# EAGLE design Controller (EAGLE 9.6.2)
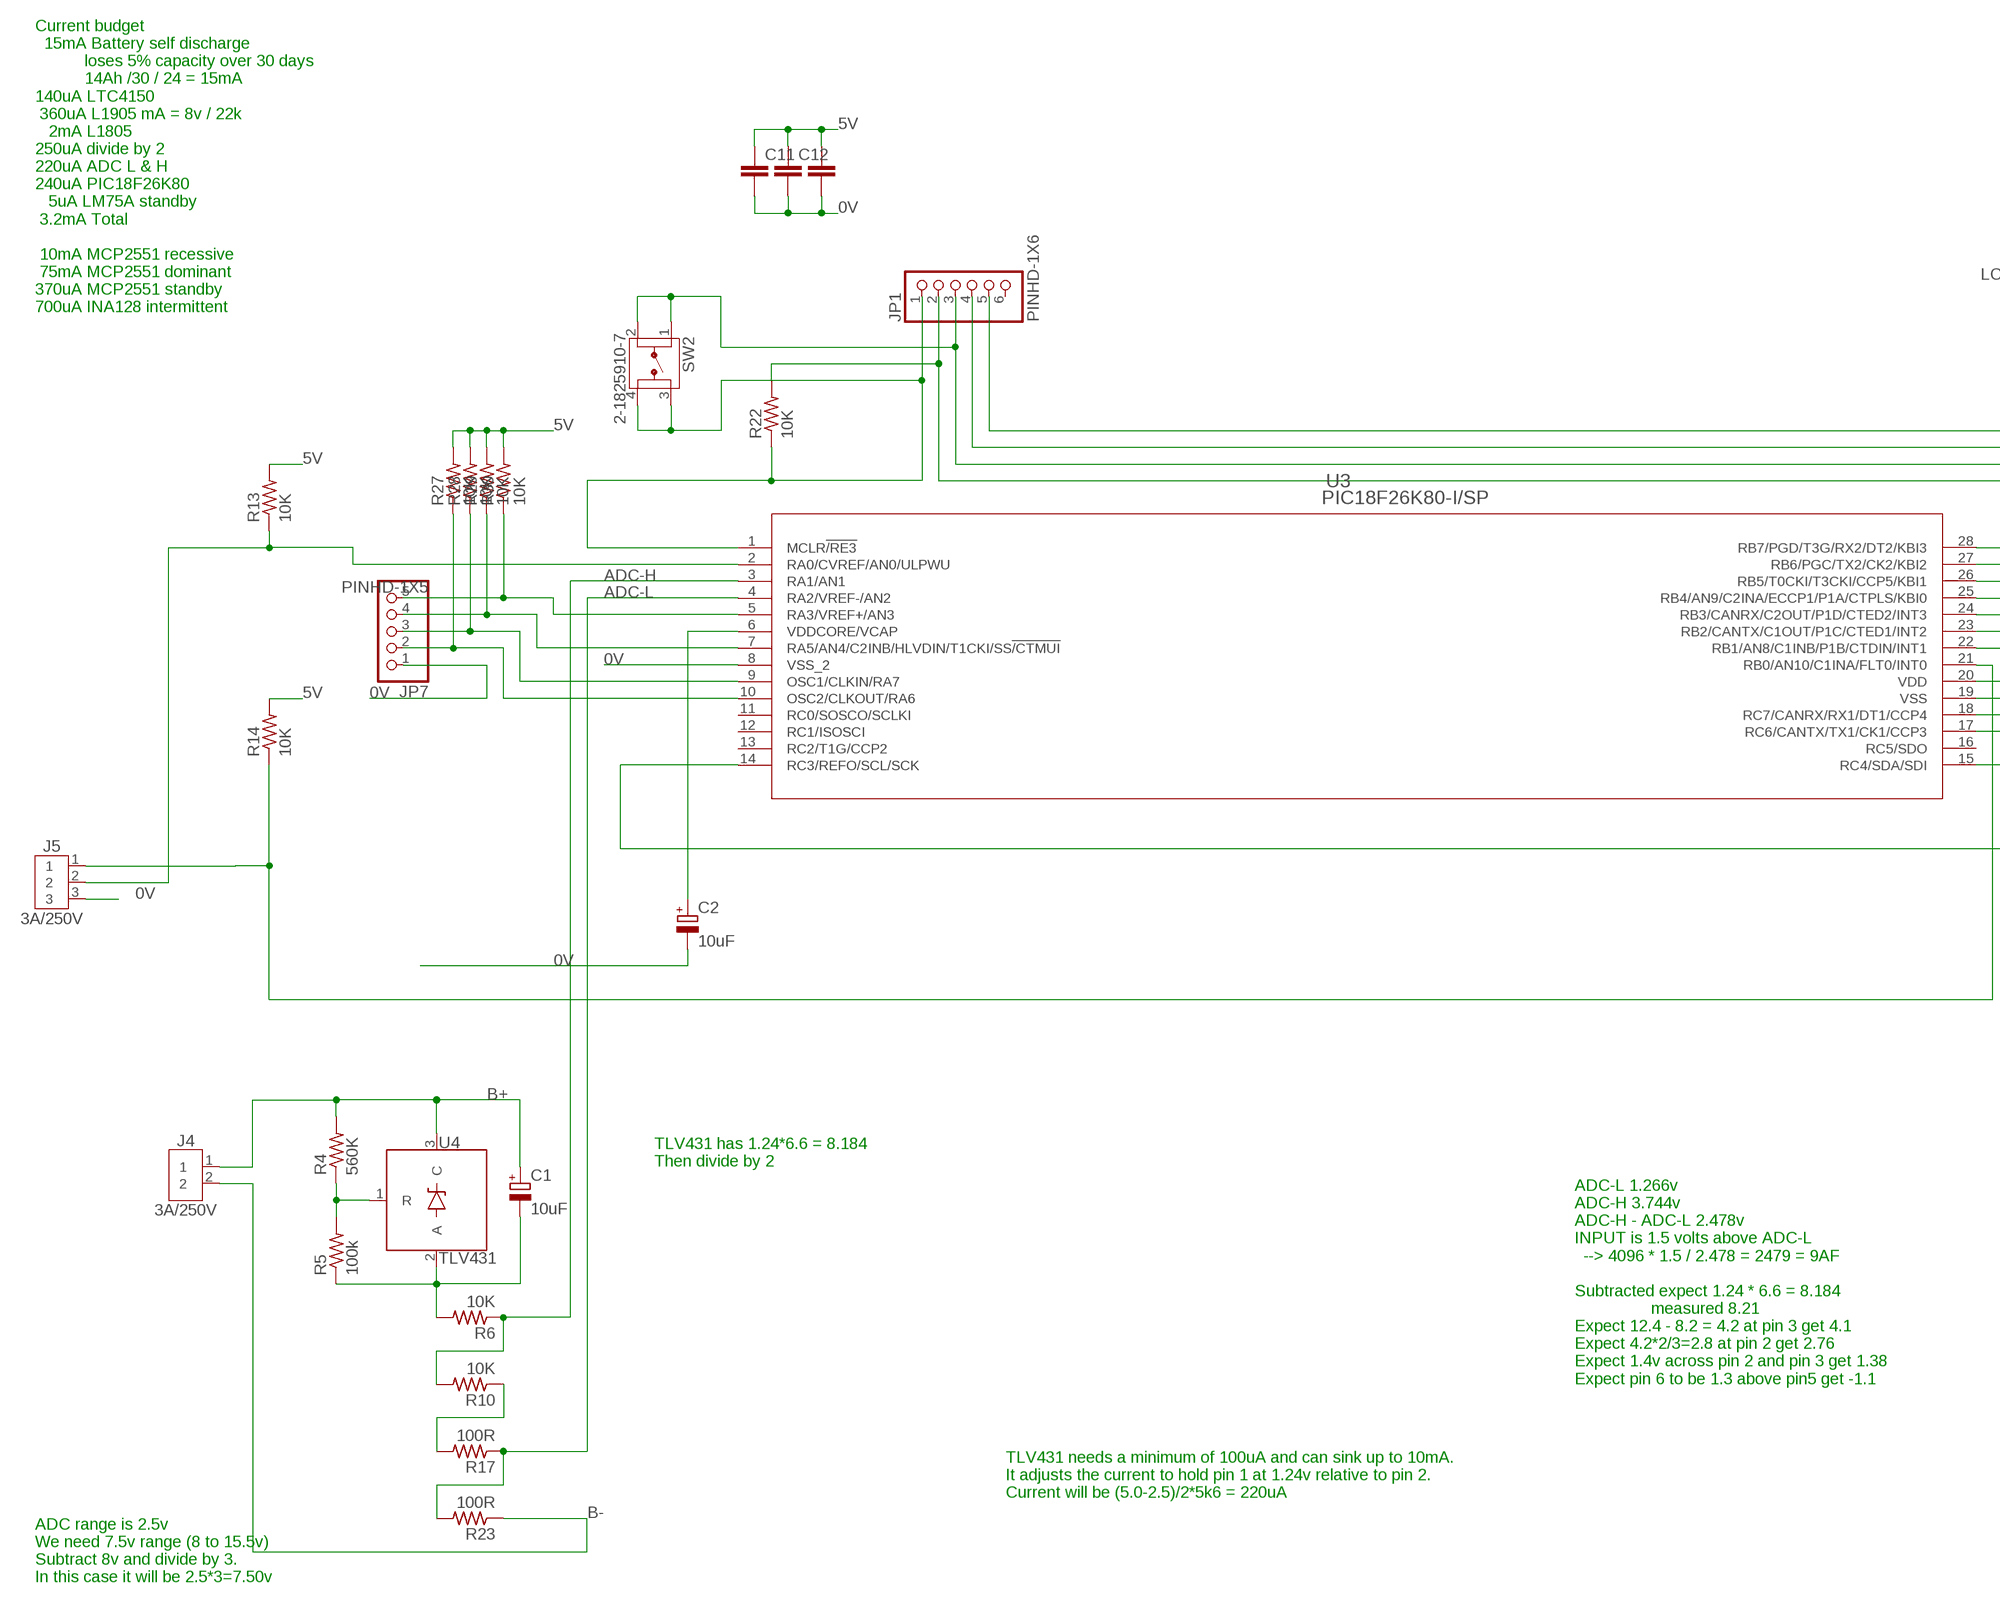
[diagram p0: schematic, sheet 1, part 1 of 2]
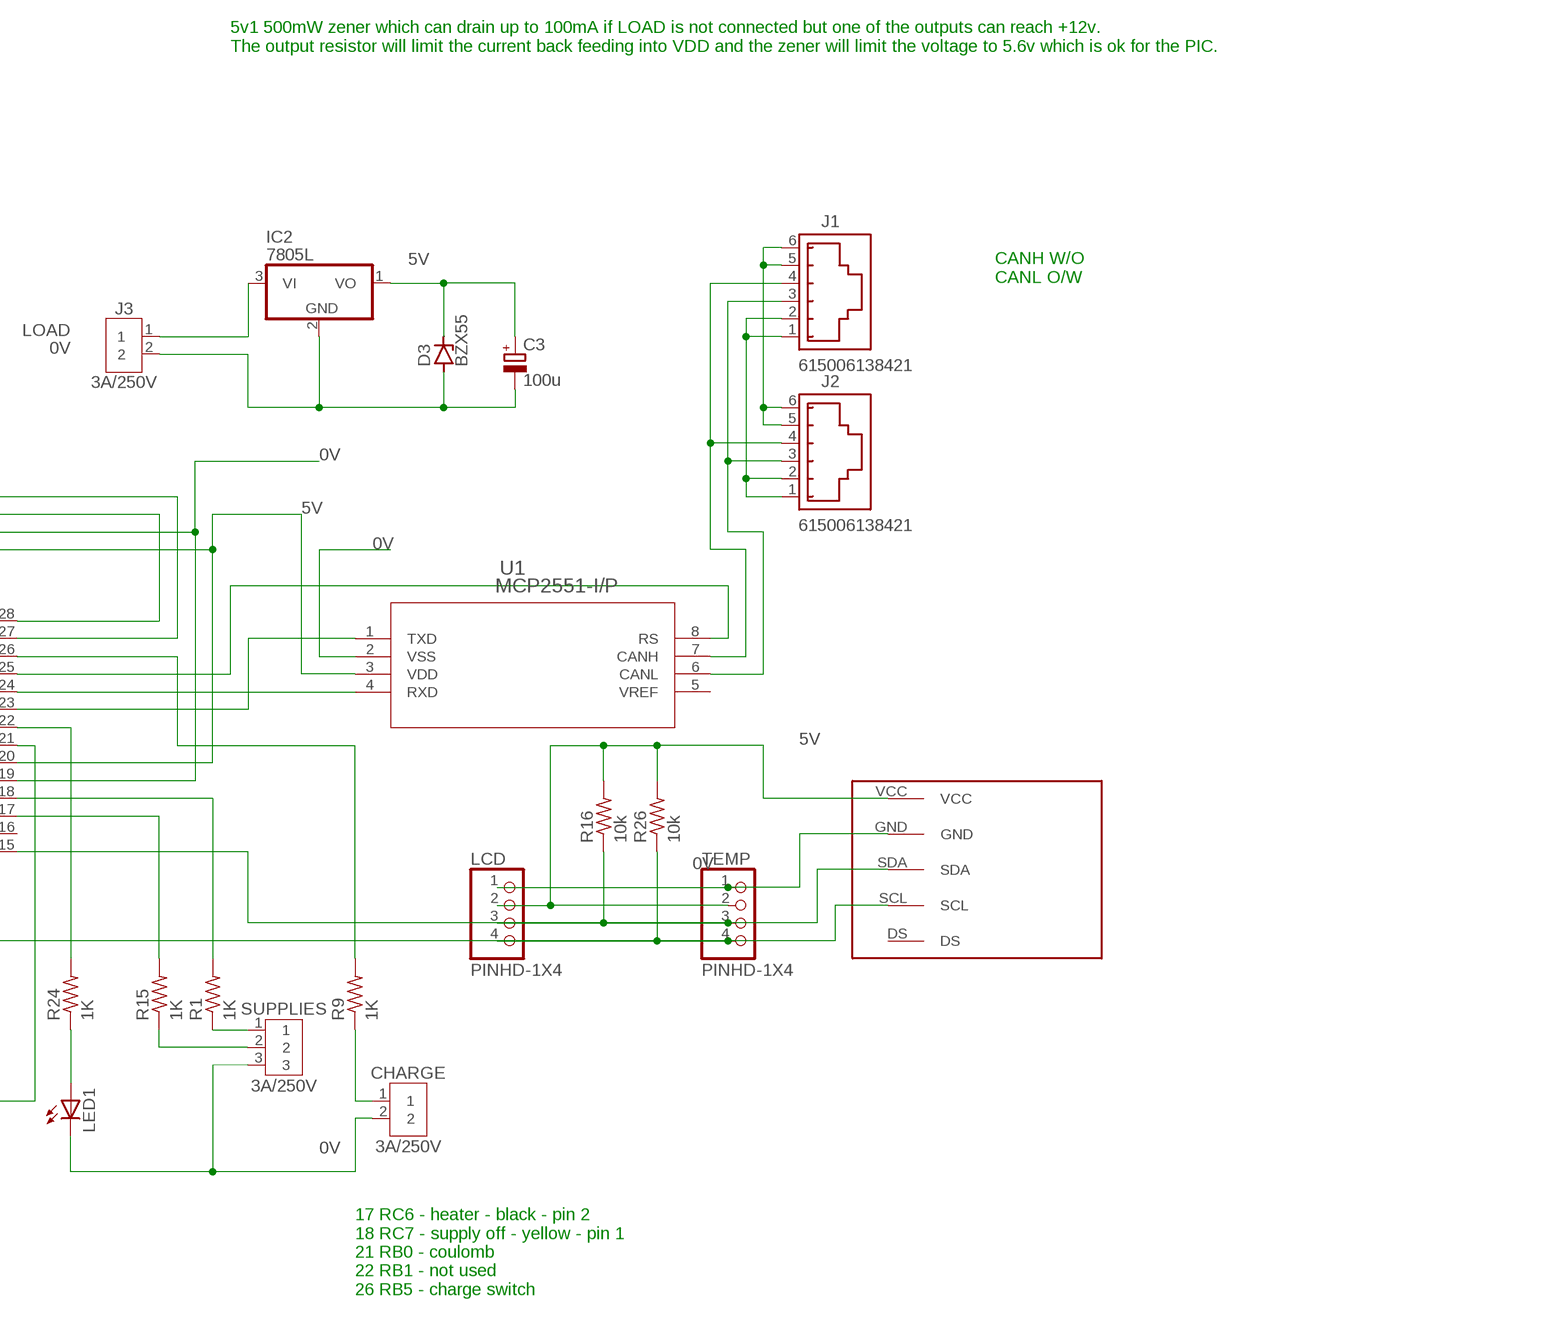
[diagram p1: schematic, sheet 1, part 2 of 2]

## Parts
C1  10uF  CPOL-EUE3.5-8  [E3,5-8]
C2  10uF  CPOL-EUE3.5-8  [E3,5-8]
C3  100u  CPOL-EUE3.5-8  [E3,5-8]
C7  C2,5-3  [C2.5-3]
C11  C2,5-3  [C2.5-3]
C12  C2,5-3  [C2.5-3]
CHARGE  3A/250V  B2B-XH-A  [B2B-XH-A]
D3  BZX55  [DO35Z10]
IC2  7805L  [TO92]
J1  615006138421  [615006138421]
J2  615006138421  [615006138421]
J3  3A/250V  B2B-XH-A  [B2B-XH-A]
J4  3A/250V  B2B-XH-A  [B2B-XH-A]
J5  3A/250V  B3B-XH-A  [B3B-XH-A]
JP1  PINHD-1X6  [1X06]
JP7  PINHD-1X5  [1X05]
LCD  PINHD-1X4  [1X04]
LED1  LED3MM  [LED3MM]
R1  1K  RES_7  [0204/7]
R4  560K  RES_7  [0204/7]
R5  100k  RES_7  [0204/7]
R6  10K  RES_7  [0204/7]
R9  1K  RES_7  [0204/7]
R10  10K  RES_7  [0204/7]
R13  10K  RES_7  [0204/7]
R14  10K  RES_7  [0204/7]
R15  1K  RES_7  [0204/7]
R16  10k  RES_7  [0204/7]
R17  100R  RES_7  [0204/7]
R22  10K  RES_7  [0204/7]
R23  100R  RES_7  [0204/7]
R24  1K  RES_7  [0204/7]
R26  10k  RES_7  [0204/7]
R27  10K  RES_70204/7-90  [0204/7-90]
R28  10K  RES_70204/7-90  [0204/7-90]
R29  10K  RES_70204/7-90  [0204/7-90]
R30  10K  RES_70204/7-90  [0204/7-90]
SUPPLIES  3A/250V  B3B-XH-A  [B3B-XH-A]
SW2  2-1825910-7  [2-1825910-7]
TEMP  PINHD-1X4  [1X04]
U1  MCP2551-I/P  [PDIP8_300MC_MCH]
U3  PIC18F26K80-I/SP  [SPDIP28_300MC_MCH]
U4  TLV431  [TO92]
U$1  LM75  [LM75]

## Nets
0V: C2.- C3.- C7.2 C11.2 C12.2 CHARGE.2 D3.A IC2.2(GND) J3.2 J5.3 JP1.3 JP7.1 LCD.1 LED1.K(C) SUPPLIES.3 SW2.1 SW2.2 TEMP.1 U1.2(VSS) U3.8(VSS_2) U3.19(VSS) U$1.GND
5V: C3.+ C7.1 C11.1 C12.1 D3.C IC2.1(VO) JP1.2 LCD.2 R13.2 R14.2 R16.2 R22.2 R26.2 R27.2 R28.2 R29.2 R30.2 TEMP.2 U1.3(VDD) U3.20(VDD) U$1.VCC
ADC-H: R6.1 R10.2 U3.3(RA1/AN1)
ADC-L: R17.1 R23.2 U3.4(RA2/VREF-/AN2)
B+: C1.+ J4.1 R4.2 U4.3(C)
B-: J4.2 R23.1
LCD: LCD.3 R16.1 TEMP.3 U3.15(RC4/SDA/SDI) U$1.SDA
LOAD: IC2.3(VI) J3.1
N$1: U1.4(RXD) U3.24(RB3/CANRX/C2OUT/P1D/CTED2/INT3)
N$2: U1.1(TXD) U3.23(RB2/CANTX/C1OUT/P1C/CTED1/INT2)
N$3: R1.2 U3.18(RC7/CANRX/RX1/DT1/CCP4)
N$4: J1.3 J2.3 U1.6(CANL)
N$5: JP1.1 R22.1 SW2.3 SW2.4 U3.1(MCLR!/RE3)
N$7: LCD.4 R26.1 TEMP.4 U3.14(RC3/REFO/SCL/SCK) U$1.SCL
N$8: JP1.4 U3.28(RB7/PGD/T3G/RX2/DT2/KBI3)
N$9: JP1.5 U3.27(RB6/PGC/TX2/CK2/KBI2)
N$10: C1.- R5.1 R6.2 U4.2(A)
N$11: R1.1 SUPPLIES.1
N$12: R24.2 U3.22(RB1/AN8/C1INB/P1B/CTDIN/INT1)
N$13: R10.1 R17.2
N$14: C2.+ U3.6(VDDCORE/VCAP)
N$17: CHARGE.1 R9.1
N$18: R4.1 R5.2 U4.1(R)
N$28: J5.1 R14.1 U3.21(RB0/AN10/C1INA/FLT0/INT0)
N$29: J5.2 R13.1 U3.2(RA0/CVREF/AN0/ULPWU)
N$32: R15.1 SUPPLIES.2
N$33: J1.4 J2.4 U1.7(CANH)
N$34: R9.2 U3.26(RB5/T0CKI/T3CKI/CCP5/KBI1)
N$36: JP7.5 R30.1 U3.5(RA3/VREF+/AN3)
N$39: J1.5 J1.6 J2.5 J2.6
N$41: J1.1 J1.2 J2.1 J2.2
N$44: R15.2 U3.17(RC6/CANTX/TX1/CK1/CCP3)
N$45: JP7.4 R29.1 U3.7(RA5/AN4/C2INB/HLVDIN/T1CKI/SS!/CTMUI)
N$46: JP7.3 R28.1 U3.9(OSC1/CLKIN/RA7)
N$47: JP7.2 R27.1 U3.10(OSC2/CLKOUT/RA6)
N$53: LED1.A R24.1
N$54: U1.8(RS) U3.25(RB4/AN9/C2INA/ECCP1/P1A/CTPLS/KBI0)
Unconnected: JP1.6 U1.5(VREF) U3.11(RC0/SOSCO/SCLKI) U3.12(RC1/ISOSCI) U3.13(RC2/T1G/CCP2) U3.16(RC5/SDO) U$1.DS

## Notes on the sheet
- 5v1 500mW zener which can drain up to 100mA if LOAD is not connected but one of the outputs can reach +12v.
  The output resistor will limit the current back feeding into VDD and the zener will limit the voltage to 5.6v which is ok for the PIC.
- CANH W/O
  CANL O/W
- Current budget
    15mA Battery self discharge
             loses 5% capacity over 30 days
             14Ah /30 / 24 = 15mA
  140uA LTC4150
   360uA L1905 mA = 8v / 22k
     2mA L1805
  250uA divide by 2
  220uA ADC L & H
  240uA PIC18F26K80
     5uA LM75A standby
   3.2mA Total
  
   10mA MCP2551 recessive
   75mA MCP2551 dominant
  370uA MCP2551 standby
  700uA INA128 intermittent
- TLV431 has 1.24*6.6 = 8.184
  Then divide by 2
- 17 RC6 - heater - black - pin 2
  18 RC7 - supply off - yellow - pin 1
  21 RB0 - coulomb
  22 RB1 - not used
  26 RB5 - charge switch
- ADC-L 1.266v
  ADC-H 3.744v
  ADC-H - ADC-L 2.478v
  INPUT is 1.5 volts above ADC-L
    --> 4096 * 1.5 / 2.478 = 2479 = 9AF
  
  Subtracted expect 1.24 * 6.6 = 8.184
                   measured 8.21
  Expect 12.4 - 8.2 = 4.2 at pin 3 get 4.1
  Expect 4.2*2/3=2.8 at pin 2 get 2.76
  Expect 1.4v across pin 2 and pin 3 get 1.38
  Expect pin 6 to be 1.3 above pin5 get -1.1
- TLV431 needs a minimum of 100uA and can sink up to 10mA.
  It adjusts the current to hold pin 1 at 1.24v relative to pin 2.
  Current will be (5.0-2.5)/2*5k6 = 220uA
- ADC range is 2.5v
  We need 7.5v range (8 to 15.5v)
  Subtract 8v and divide by 3.
  In this case it will be 2.5*3=7.50v

## Library data of the parts
C1-C3 = andrew-boyson:CPOL-EU: POLARIZED CAPACITOR, European symbol; SPICEPREFIX: C
C7 C11 C12 = capacitor-wima:C: CAPACITOR naming: grid - package width
CHARGE J3 J4 = andrew-boyson:B2B-XH-A: XH Connector Top Entry - 2POS Details see: Datasheet <http://www.jst-mfg.com/product/pdf/eng/eXH.pdf>; CATEGORY: CONNECTOR; DESCRIPTION: 2.5mm pitch/disconnectable crimp style connector; MANUFACTURER: JST (XH CONNECTOR); MPN: B2B-XH-A; OPERATING_TEMPERATURE: -25°C ~ 85°C; PART_STATUS: ACTIVE; ROHS_COMPLIANT: COMPLIANT; SERIES: B_B-XH-A; SUB_CATEGORY: Through hole connector; TYPE: top entry
D3 = diode:BZX55: Z DIODE
IC2 = adafruit:78*: Positive VOLTAGE REGULATOR Added bigger pads to the TO-92 package
J1 J2 = Wurth_Connectors_WR-MJ:615006138421: WR-MJ Modular Jack Horizontal Plastic 6PxC Tab Up KIND PROPERTIES Quality Class:500 Mating cycles General Information Operating Temperature:-40 up to +85 °C Compliance: RoHS Electrical Properties IR 1:1.5A Working Voltage:120V (AC) Withstanding Voltage:1000V (AC) Contact Resistance:20mΩ RISO:500 MΩ Material Properties Insulator MateriaL:PBT Insulator Flammability Rating:UL94 V-0 Color:Black Contact Material Copper Alloy Contact Plating:Gold Contact Type:Stamped Packaging Properties Packaging:Tray <https://www.we-online.com/catalog/media/o33138v209%20Family_WR-MJ_61500x138421.jpg> Details see: https://www.we-online.com/catalog/en/MJ_HORIZONTAL_PLASTIC_6PXC_TAB_UP/? Updated by Yingchun,Shan 2020-01-06 2020 (C) Würth Elektronik; DATASHEET-URL: https://www.we-online.com/catalog/datasheet/615006138421.pdf; MOUNT: THT; PART-NUMBER: 615006138421; TYPE: Horizontal; XPXC: 6P6C
J5 SUPPLIES = andrew-boyson:B3B-XH-A: XH Connector Top Entry - 3POS Details see: Datasheet <http://www.jst-mfg.com/product/pdf/eng/eXH.pdf>; CATEGORY: CONNECTOR; DESCRIPTION: 2.5mm pitch/disconnectable crimp style connector; MANUFACTURER: JST (XH connector); MPN: B3B-XH-A; PART_STATUS: ACTIVE; ROHS_COMPLIANT: COMPLIANT; SERIES: B3B-XH-A; SUB_CATEGORY: THROUGH HOLE CONNECTOR; TYPE: SIDE ENTRY
JP1 = Connector:PINHD-1X6: PIN HEADER; CATEGORY: CONNECTOR; SUB-CATEGORY: PIN-HEADER
JP7 = Connector:PINHD-1X5: PIN HEADER; CATEGORY: CONNECTOR; SUB-CATEGORY: PIN-HEADER
LCD TEMP = Connector:PINHD-1X4: PIN HEADER; CATEGORY: CONNECTOR; SUB-CATEGORY: PIN-HEADER
LED1 = adafruit:LED: LED OSRAM: - CHIPLED LG R971, LG N971, LY N971, LG Q971, LY Q971, LO R971, LY R971 LH N974, LH R974 LS Q976, LO Q976, LY Q976 LO Q996 - Hyper CHIPLED LW Q18S LB Q993, LB Q99A, LB R99A - SideLED LS A670, LO A670, LY A670, LG A670, LP A670 LB A673, LV A673, LT A673, LW A673 LH A674 LY A675 LS A676, LA A676, LO A676, LY A676, LW A676 LS A679, LY A679, LG A679 - Hyper Micro SIDELED® LS Y876, LA Y876, LO Y876, LY Y876 LT Y87S - SmartLED LW L88C, LW L88S LB L89C, LB L89S, LG L890 LS L89K, LO L89K, LY L89K LS L896, LA L896, LO L896, LY L896 - TOPLED LS T670, LO T670, LY T670, LG T670, LP T670 LSG T670, LSP T670, LSY T670, LOP T670, LYG T670 LG T671, LOG T671, LSG T671 LB T673, LV T673, LT T673, LW T673 LH T674 LS T676, LA T676, LO T676, LY T676, LB T676, LH T676, LSB T676, LW T676 LB T67C, LV T67C, LT T67C, LS T67K, LO T67K, LY T67K, LW E67C LS E67B, LA E67B, LO E67B, LY E67B, LB E67C, LV E67C, LT E67C LW T67C LS T679, LY T679, LG T679 LS T770, LO T770, LY T770, LG T770, LP T770 LB T773, LV T773, LT T773, LW T773 LH T774 LS E675, LA E675, LY E675, LS T675 LS T776, LA T776, LO T776, LY T776, LB T776 LHGB T686 LT T68C, LB T68C - Hyper Mini TOPLED® LB M676 - Mini TOPLED Santana® LG M470 LS M47K, LO M47K, LY M47K Source: http://www.osram.convergy.de/
R1 R4-R6 R9 R10 R13-R17 R22-R24 R26-R30 = andrew-boyson:RES_7: RESISTOR, American symbol
SW2 = Switch:2-1825910-7: SWITCH TACTILE SPST-NO 0.05A 24V Manufacturer's datasheet <https://www.te.com/commerce/DocumentDelivery/DDEController?Action=srchrtrv&DocNm=1825910&DocType=Customer+Drawing&DocLang=English>; CREATED_BY: PCBLayout.com; DIGIKEY_PARTNO: 450-1642-ND; MANUFACTURER: TE Connectivity ALCOSWITCH Switches; MPN: 2-1825910-7
U1 = andrew-boyson:MCP2551-I/P; COPYRIGHT: Copyright (C) 2021 Ultra Librarian. All rights reserved.; MANUFACTURER_PART_NUMBER: MCP2551-I/P; MFR_NAME: Microchip
U3 = andrew-boyson:PIC18F26K80-I/SP; COPYRIGHT: Copyright (C) 2021 Ultra Librarian. All rights reserved.; MANUFACTURER_PART_NUMBER: pic18f26k80-i/sp; MFR_NAME: Microchip
U4 = andrew-boyson:TLV431: TLV431
U$1 = andrew-boyson:LM75

## Board
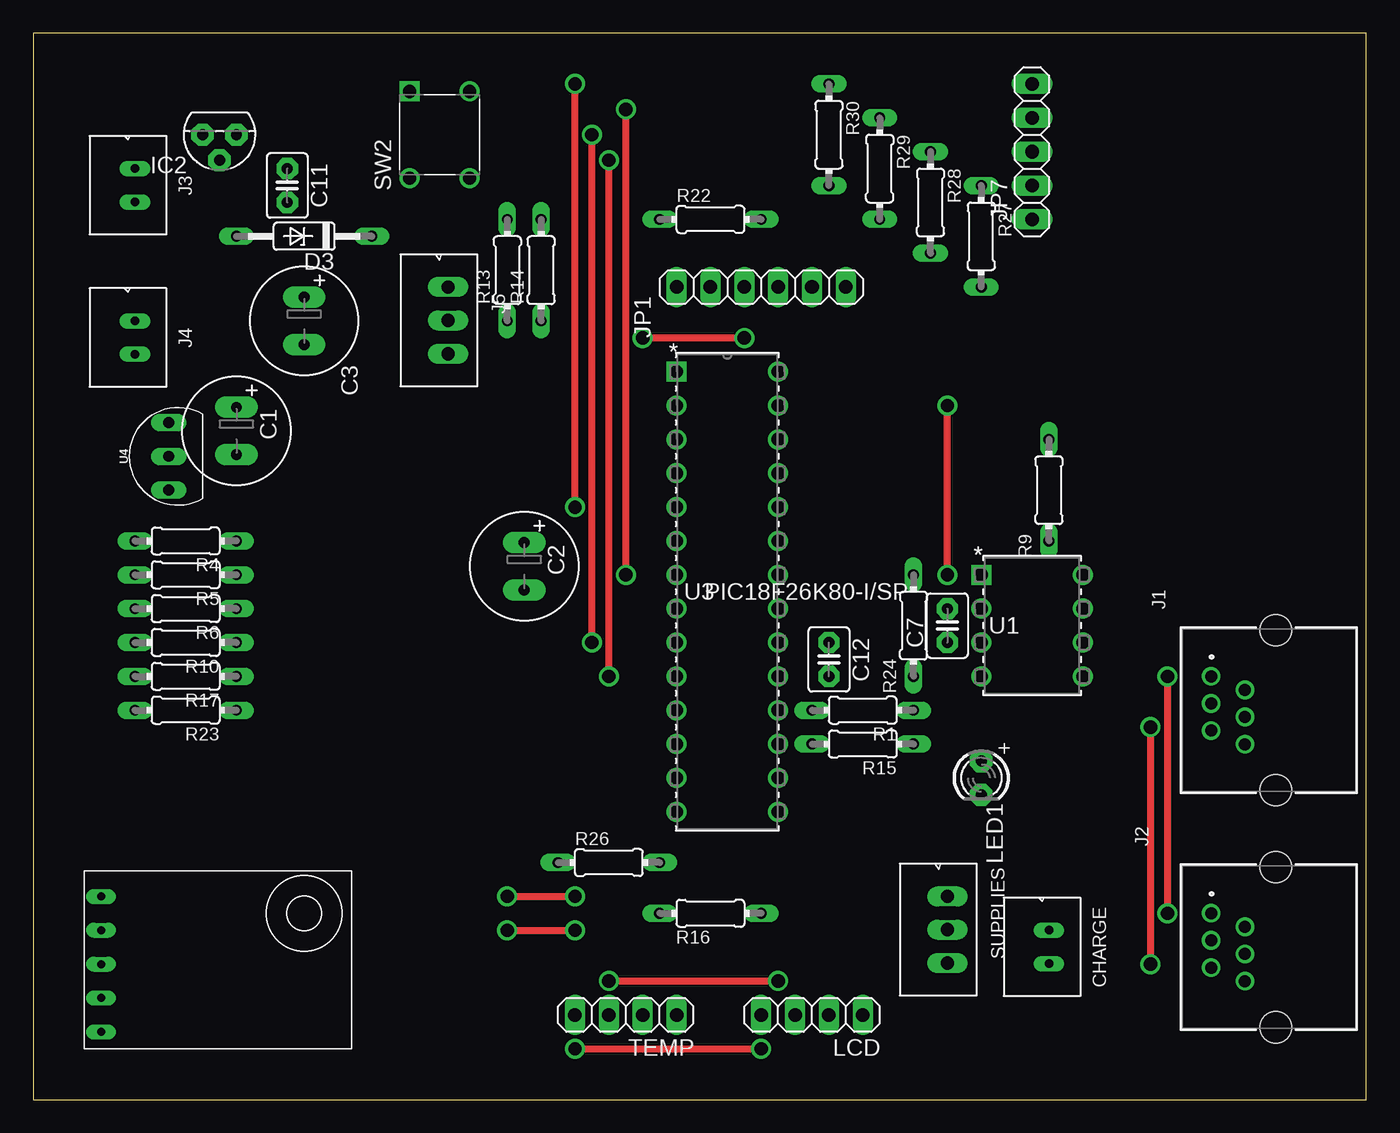
[diagram p2: board, top side]
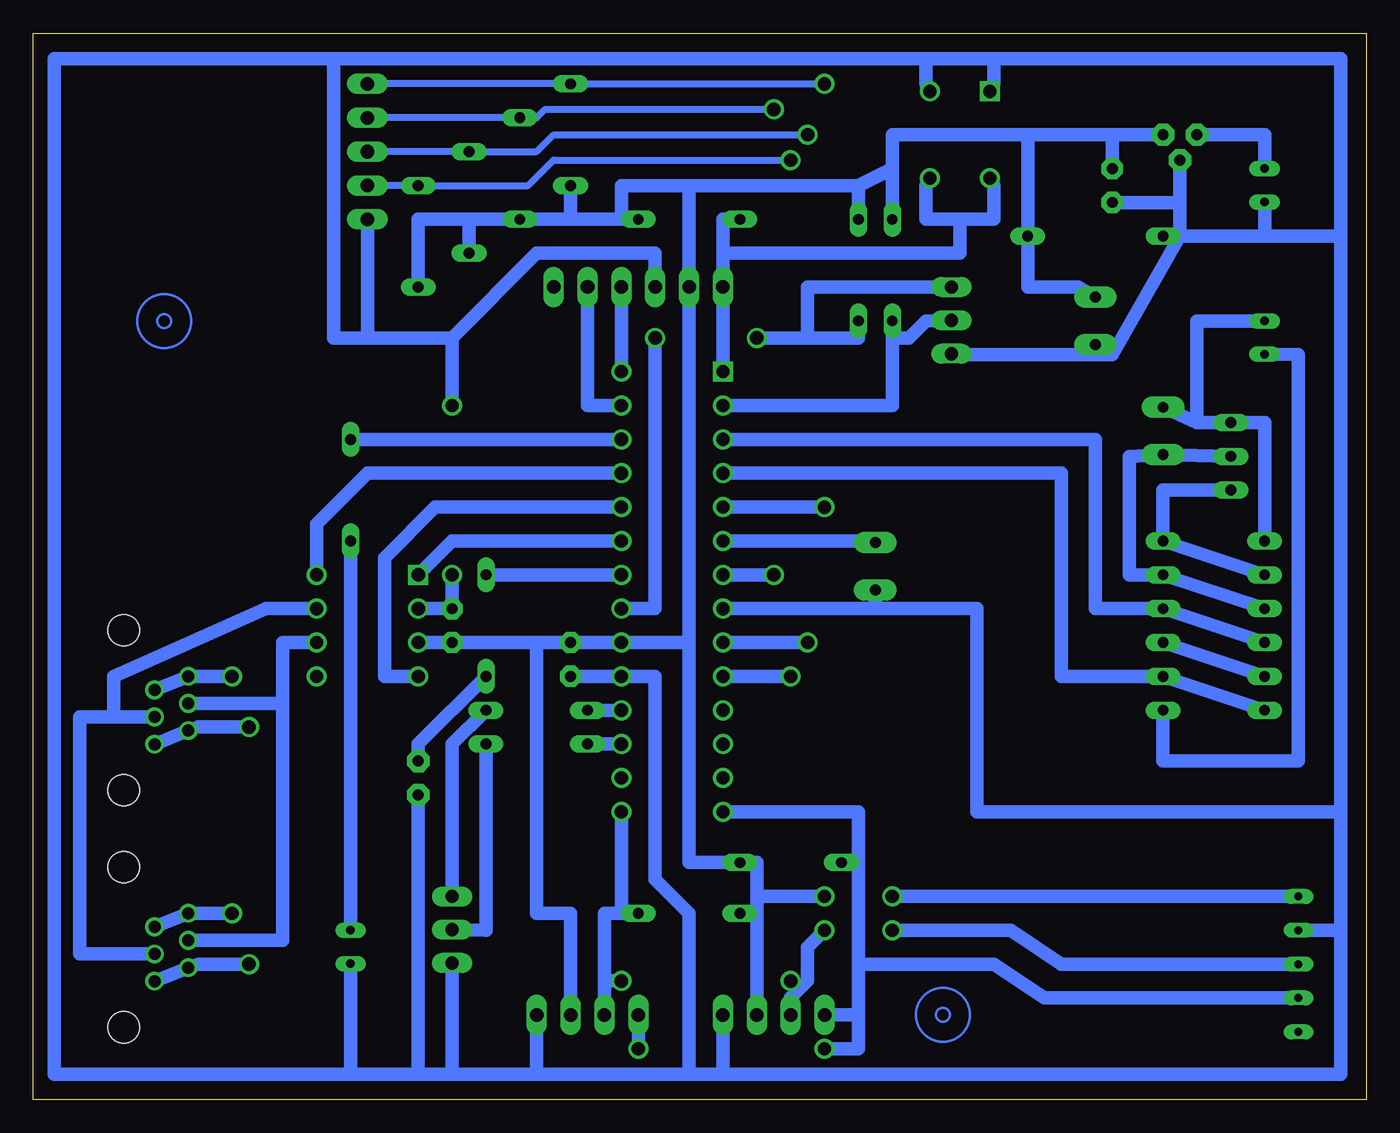
[diagram p3: board, bottom side, seen from below]

Size 100 x 80 mm. Coordinates in mm from the lower left corner, seen from the top.
Outline: 0,0 100,0 100,80 0,80 0,0
Copper layers (1*16): Top 0.035mm / dielectric 1.5mm / Bottom 0.035mm
Design rules "default": minimum track width 6mil, minimum drill 0.35mm, track to track 6mil, track to pad 6mil, pad to pad 6mil, via to via 6mil, smd to smd 6mil, copper to edge 40mil, drill to drill 6mil, minimum pad ring 10mil, minimum via ring 8mil, stop-mask expansion 4mil, vias tented up to drill 0mil, thermal gap 10mil

### Footprints (pad centres in the part's own frame; a part is rotated, then mirrored left to right if it is on the bottom)
E3,5-8 = drill 0.813 pad 1.6 long: + -1.778,0; - 1.778,0
C2.5-3 = drill 0.813 pad 1.6 octagon: 1 -1.27,0; 2 1.27,0
B2B-XH-A = drill 0.64 long: 1 0,0; 2 2.5,0
DO35Z10 = drill 0.813 long: A 5.08,0; C -5.08,0
TO92 = drill 0.813 pad 1.676 octagon: 1 -1.27,0; 2 0,1.905; 3 1.27,0
615006138421 = drill 0.9: 1 2.55,4.34; 2 1.53,1.8; 3 0.51,4.34; 4 -0.51,1.8; 5 -1.53,4.34; 6 -2.55,1.8 | hole 2.36: -6,-0.5; 6,-0.5
B3B-XH-A = drill 1 long: 1 0,1.27; 2 2.5,1.27; 3 5,1.27
1X06 = drill 1.016 long: 1 -6.35,0; 2 -3.81,0; 3 -1.27,0; 4 1.27,0; 5 3.81,0; 6 6.35,0
1X05 = drill 1.016 long: 1 -5.08,0; 2 -2.54,0; 3 0,0; 4 2.54,0; 5 5.08,0
1X04 = drill 1.016 long: 1 -3.81,0; 2 -1.27,0; 3 1.27,0; 4 3.81,0
LED3MM = drill 0.813 pad 1.676 octagon: A -1.27,0; K 1.27,0
0204/7 = drill 0.813 long: 1 -3.81,0; 2 3.81,0
0204/7-90 = drill 0.813 long: 1 -3.81,0; 2 3.81,0
2-1825910-7 = drill 0.99 square: 1 3.25,2.25 | drill 0.99: 2 3.25,-2.25; 3 -3.25,2.25; 4 -3.25,-2.25
PDIP8_300MC_MCH = drill 0.991 pad 1.499 square: 1 0,0 | drill 0.991 pad 1.499: 2 0,-2.54; 3 0,-5.08; 4 0,-7.62; 5 7.62,-7.62; 6 7.62,-5.08; 7 7.62,-2.54; 8 7.62,0
SPDIP28_300MC_MCH = drill 0.991 pad 1.499 square: 1 0,0 | drill 0.991 pad 1.499: 2 0,-2.54; 3 0,-5.08; 4 0,-7.62; 5 0,-10.16; 6 0,-12.7; 7 0,-15.24; 8 0,-17.78; 9 0,-20.32; 10 0,-22.86; 11 0,-25.4; 12 0,-27.94; 13 0,-30.48; 14 0,-33.02; 15 7.62,-33.02; 16 7.62,-30.48; 17 7.62,-27.94; 18 7.62,-25.4; 19 7.62,-22.86; 20 7.62,-20.32; 21 7.62,-17.78; 22 7.62,-15.24; 23 7.62,-12.7; 24 7.62,-10.16; 25 7.62,-7.62; 26 7.62,-5.08; 27 7.62,-2.54; 28 7.62,0
TO92' = drill 0.813 long: 1 -2.54,0; 2 0,0; 3 2.54,0
LM75 = drill 0.6 long: DS 1.27,1.27; GND 1.27,8.89; SCL 1.27,3.81; SDA 1.27,6.35; VCC 1.27,11.43

### Placement (x,y rotation side)
C1  15.24,50.16 270 top
C2  36.83,40.01 270 top
C3  20.32,58.42 270 top
C7  68.58,35.56 90 top
C11  19.05,68.58 270 top
C12  59.69,33.02 270 top
CHARGE  76.2,12.7 270 top
D3  20.32,64.77 180 top
IC2  13.97,72.39 180 top
J1  92.71,29.21 90 top
J2  92.71,11.43 90 top
J3  7.62,69.85 270 top
J4  7.62,58.42 270 top
J5  29.84,60.96 270 top
JP1  54.61,60.96 0 top
JP7  74.93,71.12 90 top
LCD  58.42,6.35 180 top
LED1  71.12,24.13 270 top
R1  62.23,29.21 180 top
R4  11.43,41.91 180 top
R5  11.43,39.37 180 top
R6  11.43,36.83 180 top
R9  76.2,45.72 90 top
R10  11.43,34.29 180 top
R13  35.56,62.23 90 top
R14  38.1,62.23 90 top
R15  62.23,26.67 180 top
R16  50.8,13.97 180 top
R17  11.43,31.75 180 top
R22  50.8,66.04 0 top
R23  11.43,29.21 180 top
R24  66.04,35.56 90 top
R26  43.18,17.78 0 top
R27  71.12,64.77 270 top
R28  67.31,67.31 270 top
R29  63.5,69.85 270 top
R30  59.69,72.39 270 top
SUPPLIES  67.31,15.24 270 top
SW2  30.48,72.39 90 top
TEMP  44.45,6.35 180 top
U1  71.12,39.37 0 top
U3  48.26,54.61 0 top
U4  TLV431  [TO92']  10.16,48.26 90 top
U$1  3.81,3.81 0 top

### Tracks (layer width: path | path; a pad name or v marks a point on that pad's centre or on a via)
0V  (via drill 1)
  Top 0.508: v68.58,39.37 v68.58,52.07
  Bottom 1.016: 1.91,12.7 1.91,1.91 48.26,1.91 | 1.91,12.7 1.91,21.59 | 1.91,21.59 1.91,64.77 | 48.26,1.91 50.8,1.91 | 50.8,1.91 62.23,1.91 | J5.3 30.48,55.88 20.32,55.88 | 20.32,55.88 19.05,55.88 13.97,64.77 | C11.2 13.97,67.31 | 13.97,67.31 13.97,64.77 | JP1.3 53.34,63.5 62.23,63.5 68.58,57.15 | TEMP.1 48.26,1.91 | v68.58,39.37 C7.2 U1.2 | C12.2 U3.19 53.34,31.75 53.34,16.51 50.8,13.97 50.8,1.91 | 62.23,1.91 68.58,1.91 | 68.58,1.91 71.12,1.91 | 71.12,1.91 76.2,1.91 | LCD.1 62.23,1.91 | JP7.1 74.93,57.15 | 68.58,57.15 74.93,57.15 | U3.8 36.83,36.83 | 36.83,36.83 29.21,36.83 29.21,21.59 1.91,21.59 | C2.- 36.83,36.83 | IC2.2 13.97,67.31 | 76.2,1.91 CHARGE.2 | SUPPLIES.3 68.58,1.91 | LED1.K 71.12,1.91 | 1.91,64.77 7.62,64.77 | 7.62,64.77 13.97,64.77 | J3.2 7.62,64.77 | D3.A 13.97,64.77 | C3.- 20.32,55.88 | 1.91,64.77 1.91,78.11 27.94,78.11 | 27.94,78.11 33.02,78.11 | 33.02,78.11 77.47,78.11 | 77.47,78.11 77.47,57.15 74.93,57.15 | 76.2,1.91 98.42,1.91 98.42,78.11 77.47,78.11 | 68.58,57.15 v68.58,52.07 | U$1.GND 1.91,12.7 | SW2.1 27.94,76.2 27.94,78.11 | SW2.2 33.02,76.2 33.02,78.11
5V  (via drill 1)
  Top 0.508: v35.56,15.24 v40.64,15.24
  Bottom 1.016: 50.8,34.29 JP1.2 50.8,68.58 | 62.23,34.29 C12.1 U3.20 50.8,34.29 | U1.3 C7.1 62.23,34.29 | 50.8,34.29 50.8,17.78 R26.2 45.72,17.78 45.72,15.24 | 45.72,13.97 45.72,15.24 | 45.72,13.97 TEMP.2 | R16.2 45.72,13.97 | IC2.1 19.05,72.39 | 19.05,72.39 25.4,72.39 | C11.1 19.05,72.39 | 25.4,72.39 D3.C 25.4,60.96 21.59,60.96 C3.+ | 25.4,72.39 35.56,72.39 35.56,69.85 | 35.56,69.85 38.1,68.58 | R14.2 38.1,68.58 | R13.2 35.56,69.85 | 38.1,68.58 50.8,68.58 | 50.8,68.58 55.88,68.58 55.88,66.04 | U$1.VCC v35.56,15.24 | 45.72,15.24 v40.64,15.24 | R22.2 55.88,66.04 | 55.88,66.04 59.69,66.04 | 59.69,66.04 R29.2 67.31,66.04 | R30.2 59.69,66.04 | 67.31,66.04 71.12,66.04 R27.2 | R28.2 67.31,66.04 | LCD.2 59.69,13.97 62.23,13.97 62.23,34.29
ADC-H
  Bottom 1.016: R10.2 R6.1 20.32,36.83 20.32,49.53 U3.3
ADC-L
  Bottom 1.016: R23.2 R17.1 22.86,31.75 22.86,46.99 U3.4
B+
  Bottom 1.016: J4.1 12.7,58.42 12.7,50.8 | R4.2 7.62,50.8 U4.3 12.7,50.8 | C1.+ 12.7,50.8
B-
  Bottom 1.016: R23.1 15.24,25.4 5.08,25.4 5.08,55.88 J4.2
LCD  (via drill 1)
  Top 0.508: v43.18,8.89 v55.88,8.89 | v35.56,12.7 v40.64,12.7
  Bottom 1.016: 55.88,13.97 R16.1 | LCD.3 57.15,8.89 | v55.88,8.89 57.15,8.89 | 57.15,8.89 57.15,13.97 55.88,13.97 | U3.15 55.88,13.97 | U$1.SDA 22.86,10.16 26.67,12.7 v35.56,12.7 | TEMP.3 43.18,7.62 42.55,8.26 | 42.55,8.26 41.91,8.89 41.91,11.43 v40.64,12.7 | v43.18,8.89 42.55,8.26
LOAD
  Bottom 1.016: J3.1 7.62,72.39 IC2.3
N$1
  Bottom 1.016: U1.4 73.66,31.75 73.66,40.64 69.85,44.45 U3.24
N$2
  Bottom 1.016: U1.1 68.58,41.91 U3.23
N$3
  Bottom 1.016: U3.18 R1.2
N$4
  Bottom 1.016: U1.6 81.28,34.29 81.28,29.72 | J2.3 86.36,11.94 81.28,11.94 81.28,29.72 | J1.3 81.28,29.72
N$5
  Bottom 1.016: R22.1 48.26,66.04 48.26,63.5 | 48.26,63.5 JP1.1 U3.1 | SW2.3 27.94,68.58 27.94,66.04 30.48,66.04 | 30.48,66.04 33.02,66.04 33.02,68.58 SW2.4 | 30.48,66.04 30.48,63.5 48.26,63.5
N$7  (via drill 1)
  Top 0.508: v40.64,3.81 v54.61,3.81
  Bottom 1.016: v54.61,3.81 LCD.4 | U3.14 38.1,21.59 38.1,17.78 | 38.1,17.78 38.1,10.16 | 38.1,10.16 38.1,6.35 | 38.1,6.35 TEMP.4 | R26.1 38.1,17.78 | v40.64,3.81 38.1,3.81 38.1,6.35 | 38.1,10.16 27.94,10.16 24.13,7.62 U$1.SCL
N$8
  Bottom 1.016: JP1.4 U3.28
N$9
  Bottom 1.016: JP1.5 58.42,52.07 U3.27
N$10
  Bottom 1.016: U4.2 C1.- 17.78,48.26 17.78,39.37 R5.1 R6.2
N$11
  Bottom 1.016: R1.1 68.58,26.67 SUPPLIES.1
N$12
  Bottom 1.016: U3.22 R24.2
N$13
  Bottom 1.016: R17.2 R10.1
N$14
  Bottom 1.016: U3.6 38.1,41.91 C2.+
N$17
  Bottom 1.016: R9.1 CHARGE.1
N$18
  Bottom 1.016: R5.2 R4.1 15.24,45.72 U4.1
N$28  (via drill 1)
  Top 0.508: v53.34,57.15 v45.72,57.15
  Bottom 1.016: J5.1 41.91,60.96 41.91,57.15 | 41.91,57.15 v45.72,57.15 | R14.1 38.1,57.15 41.91,57.15 | U3.21 53.34,36.83 v53.34,57.15
N$29
  Bottom 1.016: U3.2 35.56,52.07 35.56,57.15 | R13.1 35.56,57.15 | 35.56,57.15 34.29,57.15 33.02,58.42 J5.2
N$32
  Bottom 1.016: R15.1 66.04,12.7 SUPPLIES.2
N$33
  Bottom 1.016: J1.4 92.71,28.7 93.98,28.7 | J2.4 92.71,10.92 96.52,10.92 96.52,28.7 93.98,28.7 | 93.98,28.7 93.98,31.75 82.55,36.83 U1.7
N$34
  Bottom 1.016: U3.26 R9.2
N$36  (via drill 1)
  Top 0.508: v40.64,44.45 v40.64,76.2
  Bottom 0.508: JP7.5 R30.1 v40.64,76.2
  Bottom 1.016: U3.5 v40.64,44.45
N$39  (via drill 1)
  Top 0.508: v83.82,27.94 v83.82,10.16
  Bottom 1.016: J2.6 J2.5 87.63,10.16 v83.82,10.16 | J1.6 J1.5 87.63,27.94 v83.82,27.94
N$41  (via drill 1)
  Top 0.508: v85.09,31.75 v85.09,13.97
  Bottom 1.016: J1.2 J1.1 v85.09,31.75 | J2.2 J2.1 v85.09,13.97
N$44
  Bottom 1.016: U3.17 R15.2
N$45  (via drill 1)
  Top 0.508: v44.45,39.37 v44.45,74.3
  Bottom 0.508: JP7.4 R29.1 62.23,73.66 61.59,74.3 v44.45,74.3
  Bottom 1.016: U3.7 v44.45,39.37
N$46  (via drill 1)
  Top 0.508: v41.91,34.29 v41.91,72.39
  Bottom 0.508: JP7.3 R28.1 62.23,71.12 60.96,72.39 v41.91,72.39
  Bottom 1.016: U3.9 v41.91,34.29
N$47  (via drill 1)
  Top 0.508: v43.18,31.75 v43.18,70.48
  Bottom 0.508: JP7.2 R27.1 62.87,68.58 60.96,70.48 v43.18,70.48
  Bottom 1.016: U3.10 v43.18,31.75
N$53
  Bottom 1.016: R24.1 71.12,26.67 LED1.A
N$54
  Bottom 1.016: U1.8 78.74,43.18 74.93,46.99 U3.25
(copper drawn outside any net)
  shapes: Bottom circle x4